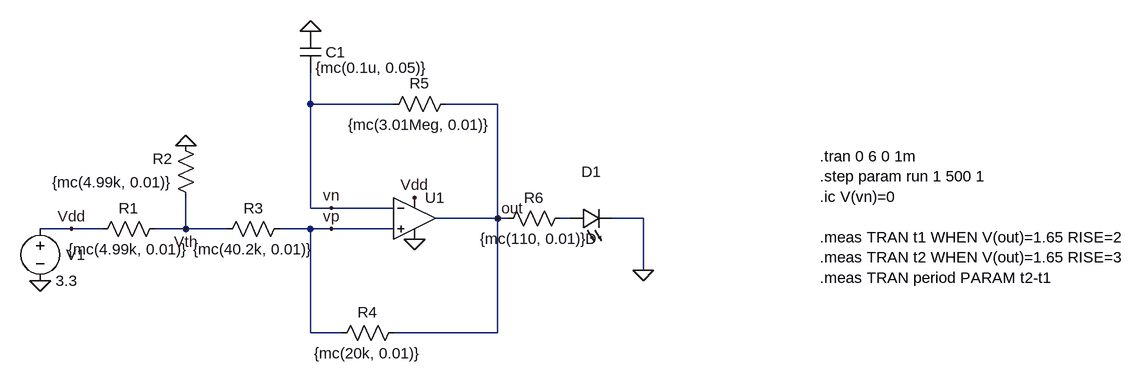
[diagram p0: schematic sim.asc]
sim.asc, the LTspice schematic file:
Version 4.1
SHEET 1 1640 680
WIRE 352 -96 352 -144
WIRE 480 -96 352 -96
WIRE 640 -96 560 -96
WIRE 352 64 352 -96
WIRE 384 64 352 64
WIRE 480 64 384 64
WIRE 640 80 640 -96
WIRE 640 80 544 80
WIRE 656 80 640 80
WIRE 752 80 736 80
WIRE 864 80 816 80
WIRE -16 96 -64 96
WIRE 32 96 -16 96
WIRE 160 96 160 48
WIRE 160 96 112 96
WIRE 224 96 160 96
WIRE 352 96 304 96
WIRE 384 96 352 96
WIRE 480 96 384 96
WIRE 864 160 864 80
WIRE 352 256 352 96
WIRE 400 256 352 256
WIRE 640 256 640 80
WIRE 640 256 480 256
FLAG -64 176 0
FLAG 160 -32 0
FLAG 352 -208 0
FLAG -16 96 Vdd
FLAG 160 96 Vth
FLAG 384 96 vp
FLAG 384 64 vn
FLAG 512 112 0
FLAG 512 48 Vdd
FLAG 864 160 0
FLAG 640 80 out
SYMBOL voltage -64 80 R0
WINDOW 0 40 56 Left 2
WINDOW 123 0 0 Left 0
WINDOW 39 0 0 Left 0
SYMATTR InstName V1
SYMATTR Value 3.3
SYMBOL res 128 80 R90
WINDOW 0 0 56 VBottom 2
WINDOW 3 32 56 VTop 2
SYMATTR InstName R1
SYMATTR Value {mc(4.99k, 0.01)}
SYMBOL res 176 64 R180
WINDOW 0 36 76 Left 2
WINDOW 3 36 40 Left 2
SYMATTR InstName R2
SYMATTR Value {mc(4.99k, 0.01)}
SYMBOL res 320 80 R90
WINDOW 0 0 56 VBottom 2
WINDOW 3 32 56 VTop 2
SYMATTR InstName R3
SYMATTR Value {mc(40.2k, 0.01)}
SYMBOL res 496 240 R90
WINDOW 0 0 56 VBottom 2
WINDOW 3 32 56 VTop 2
SYMATTR InstName R4
SYMATTR Value {mc(20k, 0.01)}
SYMBOL res 576 -112 R90
WINDOW 0 0 56 VBottom 2
WINDOW 3 32 56 VTop 2
SYMATTR InstName R5
SYMATTR Value {mc(3.01Meg, 0.01)}
SYMATTR SpiceLine tol=1
SYMBOL cap 336 -208 R0
WINDOW 0 39 32 Left 2
SYMATTR InstName C1
SYMATTR Value {mc(0.1u, 0.05)}
SYMBOL OpAmps\\UniversalOpAmp2 512 80 R0
SYMATTR InstName U1
SYMBOL res 752 64 R90
WINDOW 0 0 56 VBottom 2
WINDOW 3 32 56 VTop 2
SYMATTR InstName R6
SYMATTR Value {mc(110, 0.01)}
SYMBOL LED 752 96 R270
WINDOW 0 72 32 VTop 2
WINDOW 3 0 32 VBottom 2
SYMATTR InstName D1
TEXT 1136 -16 Left 2 !.tran 0 6 0 1m\n.step param run 1 500 1\n.ic V(vn)=0\n \n.meas TRAN t1 WHEN V(out)=1.65 RISE=2\n.meas TRAN t2 WHEN V(out)=1.65 RISE=3\n.meas TRAN period PARAM t2-t1

The netlist it stands for:
* sim.asc
V1 Vdd 0 3.3
R1 Vth Vdd {mc(4.99k, 0.01)}
R2 Vth 0 {mc(4.99k, 0.01)}
R3 vp Vth {mc(40.2k, 0.01)}
R4 out vp {mc(20k, 0.01)}
R5 out vn {mc(3.01Meg, 0.01)} tol=1
C1 0 vn {mc(0.1u, 0.05)}
X§U1 vp vn Vdd 0 out level2 Avol=1Meg GBW=10Meg Slew=10Meg Ilimit=25m Rail=0 Vos=0 En=0 Enk=0 In=0 Ink=0 Rin=500Meg  ; pins In+ In- V+ V- OUT
R6 N001 out {mc(110, 0.01)}
D1 N001 0 D
.model D D
.lib standard.dio
.tran 0 6 0 1m
.step param run 1 500 1
.ic V(vn)=0
.meas TRAN t1 WHEN V(out)=1.65 RISE=2
.meas TRAN t2 WHEN V(out)=1.65 RISE=3
.meas TRAN period PARAM t2-t1
.lib UniversalOpAmp2.lib
.backanno
.end